# Altium schematic sheet mini_system.SchDoc
size A4; SheetNumber: 1; SheetTotal: 1; SPICEModelCacheKHOQBMBG: <root> / <DocumentId>KHOQBMBG</DocumentId> / <CacheFrame Number="0"> / <Model Name="xtal" Kind="CKT"> / <Text>*Generic type:crystal pkg:HC33/51 / .SUBCKT XTAL 1 2 PARAMS: FREQ=1Meg RS=750 C=13pf Q=1000 / LX 1 3 {((Q*RS)/(6.2831852*FREQ))} IC=0.5M / CX 3 4 {(1/(Q*6.2831852*FREQ*RS))} / C0 1 2 {C} / RS 4 2 {RS} / .ENDS XTAL</Text> / </Model> / <Model Name="cap" Kind="MDL"> / <Text>*Default semiconductor capacitor / .MODEL CAP C()</Text> / </Model> / </CacheFrame> / </root>
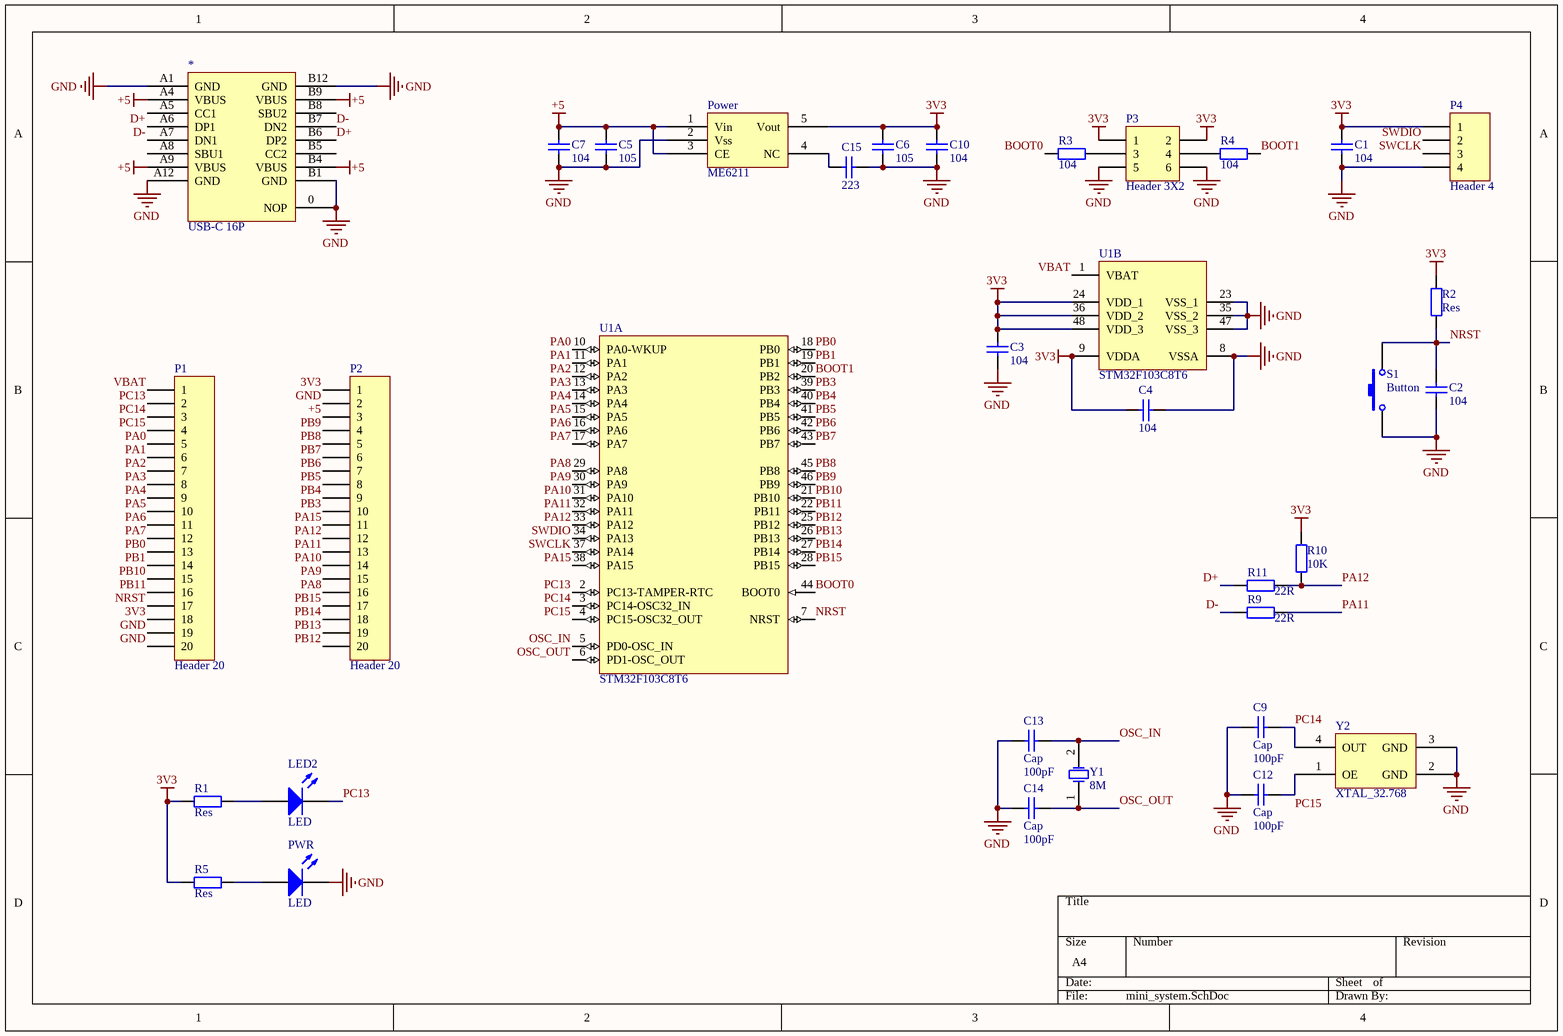
[diagram p0: mini_system.SchDoc]

## Parts
*  USB-C 16P  [USB-C 16P]
C1  104  [1608[0603]]
C2  104  [1608[0603]]
C3  104  [1608[0603]]
C4  104  [1608[0603]]
C5  105  [6-0805_M]
C6  105  [6-0805_M]
C7  104  [1608[0603]]
C9  Cap  value 100pF  [1608[0603]]
C10  104  [1608[0603]]
C12  Cap  value 100pF  [1608[0603]]
C13  Cap  value 100pF  [1608[0603]]
C14  Cap  value 100pF  [1608[0603]]
C15  223  [1608[0603]]
LED2  LED  [LED]
P1  Header 20  [HDR1X20]
P2  Header 20  [HDR1X20]
P3  Header 3X2  [HDR2X3]
P4  Header 4  [HDR1X4]
Power  ME6211  [ME6211]
PWR  LED  [LED]
R1  Res  [1608[0603]]
R2  Res  [1608[0603]]
R3  104  [1608[0603]]
R4  104  [1608[0603]]
R5  Res  [1608[0603]]
R9  22R  [1608[0603]]
R10  10K  [1608[0603]]
R11  22R  [1608[0603]]
S1  Button  [BUTTON]
U1  STM32F103C8T6  [STM-LQFP48_N]  (parts A,B of 2)
Y1  8M  [XTAL3]
Y2  XTAL_32.768  [MC-306]

## Nets
3V3: C1.2 C3.2 C4.2 C6.2 C10.2 P1.18 P2.1 P3.1 P3.2 P4.1 Power.5(Vout) R1.1 R2.2 R5.1 R10.1 U1.9(VDDA) U1.24(VDD_1) U1.36(VDD_2) U1.48(VDD_3)
+5: *.A4(VBUS) *.A9(VBUS) *.B4(VBUS) *.B9(VBUS) C5.2 C7.2 P2.3 Power.1(Vin) Power.3(CE)
GND: *.0(NOP) *.A1(GND) *.A12(GND) *.B1(GND) *.B12(GND) C1.1 C2.1 C3.1 C4.1 C5.1 C6.1 C7.1 C9.2 C10.1 C12.1 C13.2 C14.1 C15.2 P1.19 P1.20 P2.2 P3.5 P3.6 P4.4 Power.2(Vss) PWR.2(K) S1.1 U1.8(VSSA) U1.23(VSS_1) U1.35(VSS_2) U1.47(VSS_3) Y2.2(GND) Y2.3(GND)
BOOT0: R3.1 U1.44(BOOT0)
BOOT1: R4.2 U1.20(PB2)
D+: *.A6(DP1) *.B6(DP2) R11.1
D-: *.A7(DN1) *.B7(DN2) R9.1
NRST: C2.2 P1.17 R2.1 S1.2 U1.7(NRST)
OSC_IN: C13.1 U1.5(PD0-OSC_IN) Y1.2(OSC2)
OSC_OUT: C14.2 U1.6(PD1-OSC_OUT) Y1.1(OSC1)
PA0: P1.5 U1.10(PA0-WKUP)
PA1: P1.6 U1.11(PA1)
PA2: P1.7 U1.12(PA2)
PA3: P1.8 U1.13(PA3)
PA4: P1.9 U1.14(PA4)
PA5: P1.10 U1.15(PA5)
PA6: P1.11 U1.16(PA6)
PA7: P1.12 U1.17(PA7)
PA8: P2.16 U1.29(PA8)
PA9: P2.15 U1.30(PA9)
PA10: P2.14 U1.31(PA10)
PA11: P2.13 R9.2 U1.32(PA11)
PA12: P2.12 R10.2 R11.2 U1.33(PA12)
PA15: P2.11 U1.38(PA15)
PB0: P1.13 U1.18(PB0)
PB1: P1.14 U1.19(PB1)
PB3: P2.10 U1.39(PB3)
PB4: P2.9 U1.40(PB4)
PB5: P2.8 U1.41(PB5)
PB6: P2.7 U1.42(PB6)
PB7: P2.6 U1.43(PB7)
PB8: P2.5 U1.45(PB8)
PB9: P2.4 U1.46(PB9)
PB10: P1.15 U1.21(PB10)
PB11: P1.16 U1.22(PB11)
PB12: P2.20 U1.25(PB12)
PB13: P2.19 U1.26(PB13)
PB14: P2.18 U1.27(PB14)
PB15: P2.17 U1.28(PB15)
PC13: LED2.2(K) P1.2 U1.2(PC13-TAMPER-RTC)
PC14: C9.1 P1.3 U1.3(PC14-OSC32_IN) Y2.4(OUT)
PC15: C12.2 P1.4 U1.4(PC15-OSC32_OUT) Y2.1(OE)
SWCLK: P4.3 U1.37(PA14)
SWDIO: P4.2 U1.34(PA13)
VBAT: P1.1 U1.1(VBAT)
NetC15_1: C15.1 Power.4(NC)
NetLED2_1: LED2.1(A) R1.2
NetP3_3: P3.3 R3.2
NetP3_4: P3.4 R4.1
NetPWR_1: PWR.1(A) R5.2

Not connected (* = marked no-connect by the designer): * A5(CC1) A8(SBU1) B5(CC2) B8(SBU2)

## Library data of the parts
C1-C7 C10 C15 = Cap: Capacitor; Value: 100pF; Published: 8-Jun-2000; LatestRevisionDate: 17-Jul-2002; LatestRevisionNote: Re-released for DXP Platform.; PackageReference: RAD-0.3; Publisher: Altium Limited; PackageDescription: Radial Cap, Thru-Hole; 2 Leads; 0.3 in Pin Spacing
C9 C12-C14 = Cap: Capacitor; Published: 8-Jun-2000; LatestRevisionDate: 17-Jul-2002; LatestRevisionNote: Re-released for DXP Platform.; PackageReference: RAD-0.3; Publisher: Altium Limited; PackageDescription: Radial Cap, Thru-Hole; 2 Leads; 0.3 in Pin Spacing
LED2 PWR = LED: Typical INFRARED GaAs LED; Published: 8-Jun-2000; LatestRevisionDate: 08-Jul-2005; LatestRevisionNote: Mech Layer 1 removed.; PackageReference: LED-0; Publisher: Altium Limited; PackageDescription: LED; 2 Leads
P1 P2 = Header 20: Header, 20-Pin; LatestRevisionDate: 17-Jul-2002; LatestRevisionNote: Re-released for DXP Platform.; Publisher: Altium Limited
P3 = Header 3X2: Header, 3-Pin, Dual row; LatestRevisionDate: 17-Jul-2002; LatestRevisionNote: Re-released for DXP Platform.; Publisher: Altium Limited
P4 = Header 4: Header, 4-Pin; LatestRevisionDate: 17-Jul-2002; LatestRevisionNote: Re-released for DXP Platform.; Publisher: Altium Limited
Power = ME6211: SOT23-5
R1-R5 R9-R11 = Res: Resistor; Published: 8-Jun-2000; LatestRevisionDate: 17-Jul-2002; LatestRevisionNote: Re-released for DXP Platform.; PackageReference: AXIAL-0.4; Publisher: Altium Limited; PackageDescription: Axial Device, Thru-Hole; 2 Leads; 0.4 in Pin Spacing
S1 = Button: Switch; Published: 24-Mar-1999; LatestRevisionDate: 17-Jul-2002; LatestRevisionNote: Re-released for DXP Platform.; PackageReference: SPST-2; Publisher: Altium Limited; PackageDescription: Switch; 2 Leads
U1 = STM32F103C8T6: ARM Cortex-M3 32-bit MCU, 64 KB Flash, 20 KB Internal RAM, 37 I/Os, 48-pin LQFP, -40 to 85 degC, Tray; A/D Converter: 2x12-bit (10 Channel); FLASH Size (Prog) (kB): 64; I/Os (High Current): 37; Internal RAM Size (kB): 20; Operating Frequency(F) (Processor speed) (MHz): 72; Supply Voltage(Vcc) min (V): 2; DatasheetVersion: Rev. 16; PackageVersion: Rev. 6, 06/2013; PackageReference: LQFP48; PackageDescription: 48-Pin Low Profile Quad Flat Package, 7 x 7 mm Body, 0.5 mm Pitch; Supplier 1: Digi-Key; Supplier Part Number 1: 497-6063-ND; Supplier 2: Farnell; Supplier Part Number 2: 1447637; Supplier 3: Newark; Supplier Part Number 3: 59M2182; Supplier 4: Newark; Supplier Part Number 4: 57P1222; Supplier 5: Mouser; Supplier Part Number 5: 511-STM32F103C8T6; Core: ARM Cortex-M3; Packing: Tray; Mounting Technology: Surface Mount; PartNumber: STM32F103C8T6; ComponentLink1Description: Manufacturer URL; ComponentLink1URL: http://www.st.com/web/en/home.html; ComponentLink2Description: Datasheet; ComponentLink2URL: http://www.st.com/st-web-ui/static/active/en/resource/technical/document/datasheet/CD00161566.pdf; ComponentLink3Description: Package Specification; ComponentLink3URL: http://www.st.com/st-web-ui/static/active/en/resource/technical/document/datasheet/DM00058181.pdf
Y1 = XTAL: Crystal Oscillator; Published: 8-Jun-2000; LatestRevisionDate: 17-Jul-2002; LatestRevisionNote: Re-released for DXP Platform.; PackageReference: R38; Publisher: Altium Limited; PackageDescription: Crystal, Thru-Hole; 2 Leads; Body 3.1 x 8.2 mm (Dia.xH)
Y2 = XTAL_32.768: 32.768kHz; Published: 8-Jun-2000; LatestRevisionDate: 17-Jul-2002; LatestRevisionNote: Re-released for DXP Platform.; PackageReference: R38; Publisher: Altium Limited; PackageDescription: Crystal, Thru-Hole; 2 Leads; Body 3.1 x 8.2 mm (Dia.xH)